# EAGLE design MIR50 (EAGLE 5.10)
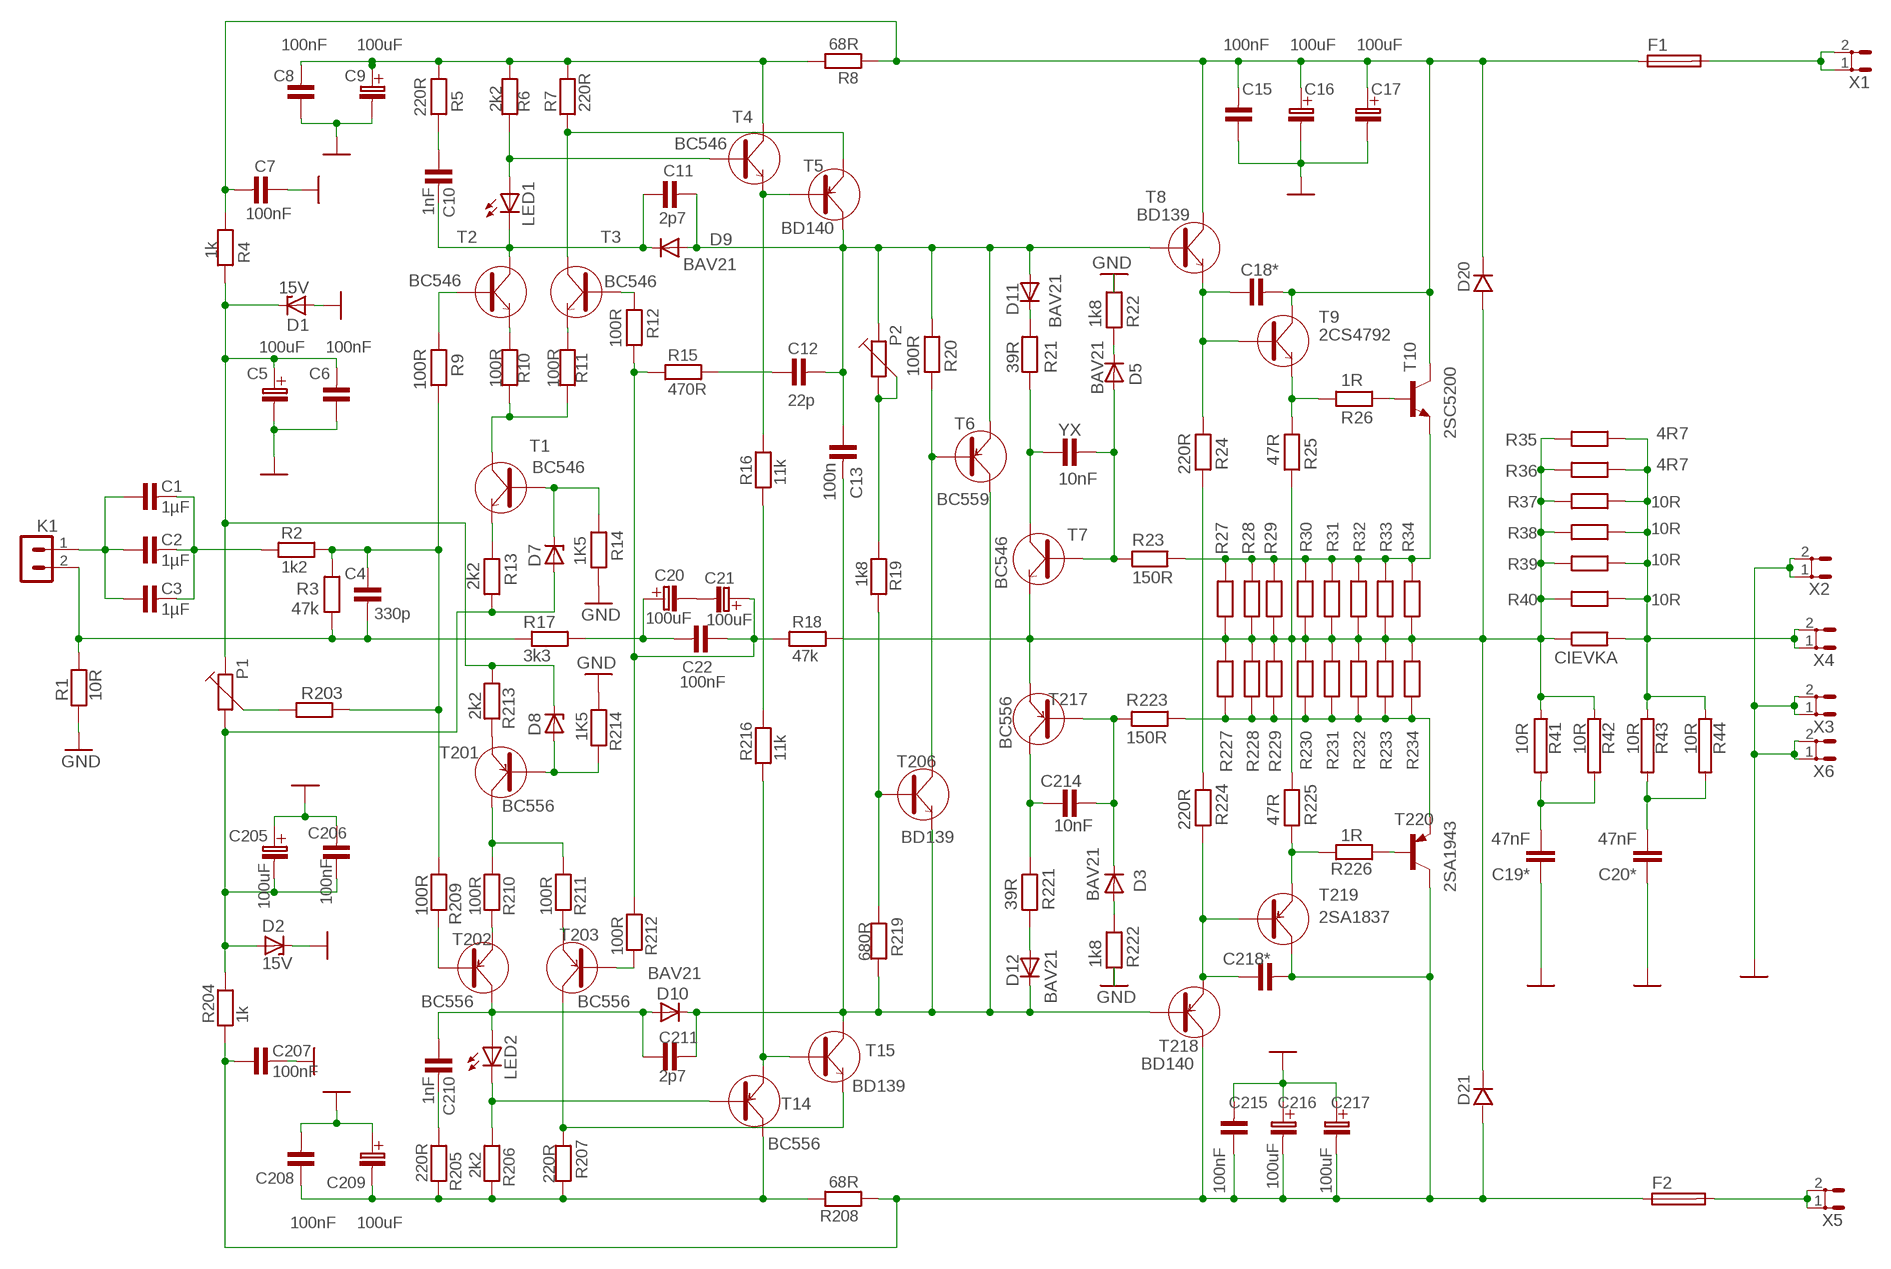
[diagram p0: schematic, sheet 1]

## Parts
C1  1µF  C-KERAMIK_5  [C-5]
C2  1µF  C-KERAMIK_5  [C-5]
C3  1µF  C-KERAMIK_5  [C-5]
C4  330p  C-KERAMIK_5  [C-5]
C5  100uF  C-ELEKTROLYT_2  [C-EL_2]
C6  100nF  C-KERAMIK_5  [C-5]
C7  100nF  C-KERAMIK_5  [C-5]
C8  100nF  C-KERAMIK_5  [C-5]
C9  100uF  C-ELEKTROLYT_3,5  [C-EL_3,5]
C10  1nF  C-KERAMIK_5  [C-5]
C11  2p7  C-KERAMIK_5  [C-5]
C12  22p  C-KERAMIK_5  [C-5]
C13  100n  C-KERAMIK_5  [C-5]
C15  100nF  C-KERAMIK_5  [C-5]
C16  100uF  C-ELEKTROLYT_3,5  [C-EL_3,5]
C17  100uF  C-ELEKTROLYT_3,5  [C-EL_3,5]
C18*  C-KERAMIK_5  [C-5]
C19*  47nF  C-EU150-054X183  [C150-054X183]
C20  100uF  C-ELEKTROLYT_3,5  [C-EL_3,5]
C20*  47nF  C-EU150-054X183  [C150-054X183]
C21  100uF  C-ELEKTROLYT_3,5  [C-EL_3,5]
C22  100nF  C-KERAMIK_5  [C-5]
C205  100uF  C-ELEKTROLYT_2  [C-EL_2]
C206  100nF  C-KERAMIK_5  [C-5]
C207  100nF  C-KERAMIK_5  [C-5]
C208  100nF  C-KERAMIK_5  [C-5]
C209  100uF  C-ELEKTROLYT_3,5  [C-EL_3,5]
C210  1nF  C-KERAMIK_5  [C-5]
C211  2p7  C-KERAMIK_5  [C-5]
C214  10nF  C-KERAMIK_5  [C-5]
C215  100nF  C-KERAMIK_5  [C-5]
C216  100uF  C-ELEKTROLYT_3,5  [C-EL_3,5]
C217  100uF  C-ELEKTROLYT_3,5  [C-EL_3,5]
C218*  C-KERAMIK_5  [C-5]
CIEVKA  10R  R-EU_0617/22  [0617/22]
D1  15V  BZD23  [SOD81]
D2  15V  BZD23  [SOD81]
D3  BAV21  [DO35-10]
D5  BAV21  [DO35-10]
D7  BZX55  [DO35Z10]
D8  BZX55  [DO35Z10]
D9  BAV21  [DO35-10]
D10  BAV21  [DO35-10]
D11  BAV21  [DO35-10]
D12  BAV21  [DO35-10]
D20  D_10  [DO41]
D21  D_10  [DO41]
F1  SH22,5A  [SH22,5A]
F2  SH22,5A  [SH22,5A]
K1  PSH02-02P  [PSH02-02P]
LED1  LED5MM  [LED5MM]
LED2  LED5MM  [LED5MM]
P1  TRIMR64Y  [64Y]
P2  TRIMR64Y  [64Y]
R1  10R  R_10  [R-10]
R2  1k2  R_10  [R-10]
R3  47k  R_10  [R-10]
R4  1k  R_10  [R-10]
R5  220R  R_10  [R-10]
R6  2k2  R_10  [R-10]
R7  220R  R_10  [R-10]
R8  68R  R_10  [R-10]
R9  100R  R_10  [R-10]
R10  100R  R_7,5  [R-7,5]
R11  100R  R_7,5  [R-7,5]
R12  100R  R_10  [R-10]
R13  2k2  R_10  [R-10]
R14  1K5  R_10  [R-10]
R15  470R  R_10  [R-10]
R16  11k  R_10  [R-10]
R17  3k3  R_10  [R-10]
R18  47k  R_10  [R-10]
R19  1k8  R_10  [R-10]
R20  100R  R_10  [R-10]
R21  39R  R_10  [R-10]
R22  1k8  R_10  [R-10]
R23  150R  R_10  [R-10]
R24  220R  R_10  [R-10]
R25  47R  R_10  [R-10]
R26  1R  R_10  [R-10]
R27  R__2W  [R-_2W]
R28  R__2W  [R-_2W]
R29  R__2W  [R-_2W]
R30  R_10  [R-10]
R31  R_10  [R-10]
R32  R_10  [R-10]
R33  R_10  [R-10]
R34  R_10  [R-10]
R35  4R7  R__2W  [R-_2W]
R36  4R7  R__2W  [R-_2W]
R37  10R  R_10  [R-10]
R38  10R  R_10  [R-10]
R39  10R  R_10  [R-10]
R40  10R  R_10  [R-10]
R41  10R  RAC01  [AC01]
R42  10R  RAC01  [AC01]
R43  10R  RAC01  [AC01]
R44  10R  RAC01  [AC01]
R203  R_10  [R-10]
R204  1k  R_10  [R-10]
R205  220R  R_10  [R-10]
R206  2k2  R_10  [R-10]
R207  220R  R_10  [R-10]
R208  68R  R_10  [R-10]
R209  100R  R_10  [R-10]
R210  100R  R_7,5  [R-7,5]
R211  100R  R_7,5  [R-7,5]
R212  100R  R_10  [R-10]
R213  2k2  R_10  [R-10]
R214  1K5  R_10  [R-10]
R216  11k  R_10  [R-10]
R219  680R  R_10  [R-10]
R221  39R  R_10  [R-10]
R222  1k8  R_10  [R-10]
R223  150R  R_10  [R-10]
R224  220R  R_10  [R-10]
R225  47R  R_10  [R-10]
R226  1R  R_10  [R-10]
R227  R__2W  [R-_2W]
R228  R__2W  [R-_2W]
R229  R__2W  [R-_2W]
R230  R_10  [R-10]
R231  R_10  [R-10]
R232  R_10  [R-10]
R233  R_10  [R-10]
R234  R_10  [R-10]
T1  BC546  [TO-92]
T2  BC546  [TO-92]
T3  BC546  [TO-92]
T4  BC546  [TO-92]
T5  BD140  [TO-126S]
T6  BC559  [TO-92]
T7  BC546  [TO-92]
T8  BD139  BD139_LEZ  [TO-126]
T9  2CS4792  BD711_LEZ  [TO-220]
T10  2SC5200  [TO-264]
T14  BC556  [TO-92]
T15  BD139  [TO-126S]
T201  BC556  [TO-92]
T202  BC556  [TO-92]
T203  BC556  [TO-92]
T206  BD139  BD139_LEZ  [TO-126]
T217  BC556  [TO-92]
T218  BD140  BD140_LEZ  [TO-126]
T219  2SA1837  BD912_LEZ  [TO-220]
T220  2SA1943  [TO-264]
X1  ST4,8  [ST4,8]
X2  ST4,8  [ST4,8]
X3  ST4,8  [ST4,8]
X4  ST4,8  [ST4,8]
X5  ST4,8  [ST4,8]
X6  ST4,8  [ST4,8]
YX  10nF  C-KERAMIK_5  [C-5]

## Nets
AERT?ZQA??: R16.1 R216.2
D7*: D8.A R214.2 T201.2(B)
GND: C5.C-(C_EL-) C6.1 C7.1 C8.1 C9.C-(C_EL-) C15.1 C16.C-(C_EL-) C17.C-(C_EL-) C19*.1 C20*.1 C205.C+(C_EL+) C206.2 C207.2 C208.2 C209.C+(C_EL+) C215.2 C216.C+(C_EL+) C217.C+(C_EL+) D1.A D2.C R1.1 R14.1 R22.2 R214.1 R222.1 X2.1 X2.2 X3.1 X3.2 X6.1 X6.2
N$1: C1.2 C2.2 C3.2 R2.1
N$2: C218*.1 R224.1 T218.1(E) T219.1(B)
N$3: C4.2 K1.2 R1.2 R3.1 R17.1
N$4: R13.2 T1.3(E)
N$5: C4.1 R2.2 R3.2 R9.1 R203.2 R209.1
N$6: R9.2 T2.2(B)
N$7: R10.2 T2.3(E)
N$8: D7.C R14.2 T1.2(B)
N$9: C205.C-(C_EL-) C206.1 D2.A D7.A P1.2 R13.1 R204.2
N$10: P1.3 R203.1
N$11: R213.2 T201.3(E)
N$12: R209.2 T202.2(B)
N$13: R210.2 T202.3(E)
N$14: R12.2 T3.2(B)
N$15: D5.C R22.1
N$16: R212.2 T203.2(B)
N$17: C7.2 C15.2 C16.C+(C_EL+) C17.C+(C_EL+) C18*.2 D20.K F1.1 R4.2 R8.1 T8.2(C) T9.2(C) T10.C
N$18: C21.C+(C_EL+) C22.1 R12.1 R15.1 R18.1 R212.1
N$19: C20.C-(C_EL-) C21.C-(C_EL-)
N$20: C8.2 C9.C+(C_EL+) R5.2 R6.2 R7.1 R8.2 T4.1(C)
N$21: C20.C+(C_EL+) C22.2 R17.2
N$22: C10.1 R5.1
N$23: C10.2 C11.1 D9.C LED1.K(C) T2.1(C)
N$24: LED2.K(C) R206.1 T14.2(B)
N$25: C19*.2 R41.2 R42.2
N$26: C18*.1 R24.2 T8.1(E) T9.1(B)
N$27: LED1.A R6.1 T4.2(B)
N$28: C210.2 R205.1
N$29: R7.2 T3.1(C) T5.1(E)
N$30: C208.1 C209.C-(C_EL-) R205.2 R206.2 R207.1 R208.2 T14.1(C)
N$31: R207.2 T15.1(E) T203.1(C)
N$33: R16.2 T4.3(E) T5.3(B)
N$34: C12.1 R15.2
N$35: C11.2 C12.2 C13.1 D9.A D11.A P2.1 R20.2 T5.2(C) T6.3(E) T8.3(B)
N$36: P2.2 P2.3 R19.1
N$37: C13.2 C211.2 D10.C D12.C R219.1 T6.1(C) T15.2(C) T206.1(E) T218.3(B)
N$38: R19.2 R219.2 T206.3(B)
N$39: R20.1 T6.2(B) T206.2(C)
N$40: R11.2 T3.3(E)
N$41: C214.2 D3.C R223.2 T217.2(B)
N$42: D11.C R21.1
N$43: R21.2 T7.1(C) YX.1
N$44: D12.A R221.1
N$45: C214.1 R221.2 T217.1(C)
N$46: D3.A R222.2
N$47: D5.A R23.1 T7.2(B) YX.2
N$49: R10.1 R11.1 T1.1(C)
N$50: R24.1 R224.2
N$51: R211.2 T203.3(E)
N$54: C207.1 C215.1 C216.C-(C_EL-) C217.C-(C_EL-) C218*.2 D21.A F2.1 R204.1 R208.1 T218.2(C) T219.2(C) T220.C
N$55: R210.1 R211.1 T201.1(C)
N$56: R25.2 R26.1 T9.3(E)
N$57: R225.1 R226.2 T219.3(E)
N$58: R23.2 R27.2 R28.2 R29.2 R30.2 R31.2 R32.2 R33.2 R34.2 T10.E
N$59: R223.1 R227.1 R228.1 R229.1 R230.1 R231.1 R232.1 R233.1 R234.1 T220.E
N$61: F1.2 X1.1 X1.2
N$62: R26.2 T10.B
N$63: F2.2 X5.1 X5.2
N$64: R226.1 T220.B
N$67: C210.1 C211.1 D10.A LED2.A T202.1(C)
N$76: CIEVKA.1 D20.A D21.K R18.2 R25.1 R27.1 R28.1 R29.1 R30.1 R31.1 R32.1 R33.1 R34.1 R35.1 R36.1 R37.2 R38.2 R39.2 R40.2 R41.1 R42.1 R225.2 R227.2 R228.2 R229.2 R230.2 R231.2 R232.2 R233.2 R234.2 T7.3(E) T217.3(E)
N$77: R216.1 T14.3(E) T15.3(B)
N$89: C5.C+(C_EL+) C6.2 D1.C D8.C P1.1 R4.1 R213.1
N$180: C20*.2 R43.2 R44.2
N$181: C1.1 C2.1 C3.1 K1.1
OUT: CIEVKA.2 R35.2 R36.2 R37.1 R38.1 R39.1 R40.1 R43.1 R44.1 X4.1 X4.2

## Library data of the parts
C1-C4 C6-C8 C11-C13 C15 C18* C22 C206-C208 C211 C214 C215 C218* YX = #PaJa_22:C-KERAMIK: Kondenzator - keramicky
C5 C9 C16 C17 C20 C21 C205 C209 C216 C217 = #PaJa_22:C-ELEKTROLYT: Kondenzator - elektrolyticky
C10 C210 = #PaJa_30:C-KERAMIK: Kondenzator - keramicky
C19* C20* = rcl:C-EU: CAPACITOR, European symbol
CIEVKA = rcl:R-EU_: RESISTOR, European symbol
D1 D2 = DIODE moje:BZD23: Z DIODE
D3 D5 D9-D12 = DIODE moje:BAV21: DIODE high-voltage general purpose diode
D7 D8 = DIODE moje:BZX55: Z DIODE
D20 D21 = #PaJa_22:D: Dioda - univerzální
F1 F2 = fuse:SH22,5A: FUSE HOLDER grid 22,5mm, isolated cap OGN0031 8201, Schurter (Buerklin)
K1 = #PaJa_22:PSH02-02: Konektory se zamkem - vidlice - 2pin
LED1 LED2 = LED moje:LED: LED OSRAM: - CHIPLED LG R971, LG N971, LY N971, LG Q971, LY Q971, LO R971, LY R971 LH N974, LH R974 LS Q976, LO Q976, LY Q976 LO Q996 - Hyper CHIPLED LW Q18S LB Q993, LB Q99A, LB R99A - SideLED LS A670, LO A670, LY A670, LG A670, LP A670 LB A673, LV A673, LT A673, LW A673 LH A674 LY A675 LS A676, LA A676, LO A676, LY A676, LW A676 LS A679, LY A679, LG A679 - Hyper Micro SIDELED® LS Y876, LA Y876, LO Y876, LY Y876 LT Y87S - SmartLED LW L88C, LW L88S LB L89C, LB L89S, LG L890 LS L89K, LO L89K, LY L89K LS L896, LA L896, LO L896, LY L896 - TOPLED LS T670, LO T670, LY T670, LG T670, LP T670 LSG T670, LSP T670, LSY T670, LOP T670, LYG T670 LG T671, LOG T671, LSG T671 LB T673, LV T673, LT T673, LW T673 LH T674 LS T676, LA T676, LO T676, LY T676, LB T676, LH T676, LSB T676, LW T676 LB T67C, LV T67C, LT T67C, LS T67K, LO T67K, LY T67K, LW E67C LS E67B, LA E67B, LO E67B, LY E67B, LB E67C, LV E67C, LT E67C LW T67C LS T679, LY T679, LG T679 LS T770, LO T770, LY T770, LG T770, LP T770 LB T773, LV T773, LT T773, LW T773 LH T774 LS E675, LA E675, LY E675, LS T675 LS T776, LA T776, LO T776, LY T776, LB T776 LHGB T686 LT T68C, LB T68C - Hyper Mini TOPLED® LB M676 - Mini TOPLED Santana® LG M470 LS M47K, LO M47K, LY M47K Source: http://www.osram.convergy.de/
P1 P2 = #PaJa_30:TRIMR: Trimr
R1-R3 R5-R9 R12-R14 R17-R19 R21 R203 R205-R208 R212-R214 R216 R219 R221 = #PaJa_30:R: Rezistor
R4 R10 R11 R15 R16 R20 R22-R40 R204 R209-R211 R222-R234 = #PaJa_22:R: Rezistor
R41-R44 = resistor-power:R: Power Resitor
T1-T4 T7 = #PaJa_22:BC546: Tranzistor NPN - Univerzalni NF - Ic=0,1A
T5 = #PaJa_22:BD140: Tranzistor PNP - Vykonovy - Ic=1,5A
T6 = #PaJa_22:BC559: Tranzistor PNP - Univerzalni NF - Ic=0,1A
T8 T206 = #PaJa_30:BD139: Tranzistor NPN - Vykonovy - Ic=1,5A
T9 = #PaJa_22:BD711: Tranzistor NPN - Vykonovy - Ic=12A
T10 = TO264:2SC5200
T14 T201-T203 T217 = #PaJa_22:BC556: Tranzistor PNP - Univerzalni NF - Ic=0,1A
T15 = #PaJa_22:BD139: Tranzistor NPN - Vykonovy - Ic=1,5A
T218 = #PaJa_30:BD140: Tranzistor PNP - Vykonovy - Ic=1,5A
T219 = #PaJa_22:BD912: Tranzistor PNP - Vykonovy - Ic=15A
T220 = TO264:2SA1943
X1-X6 = con-rib:ST4,8: RIBBON CABLE CONNECTOR Flachstecker / Faston

## Board
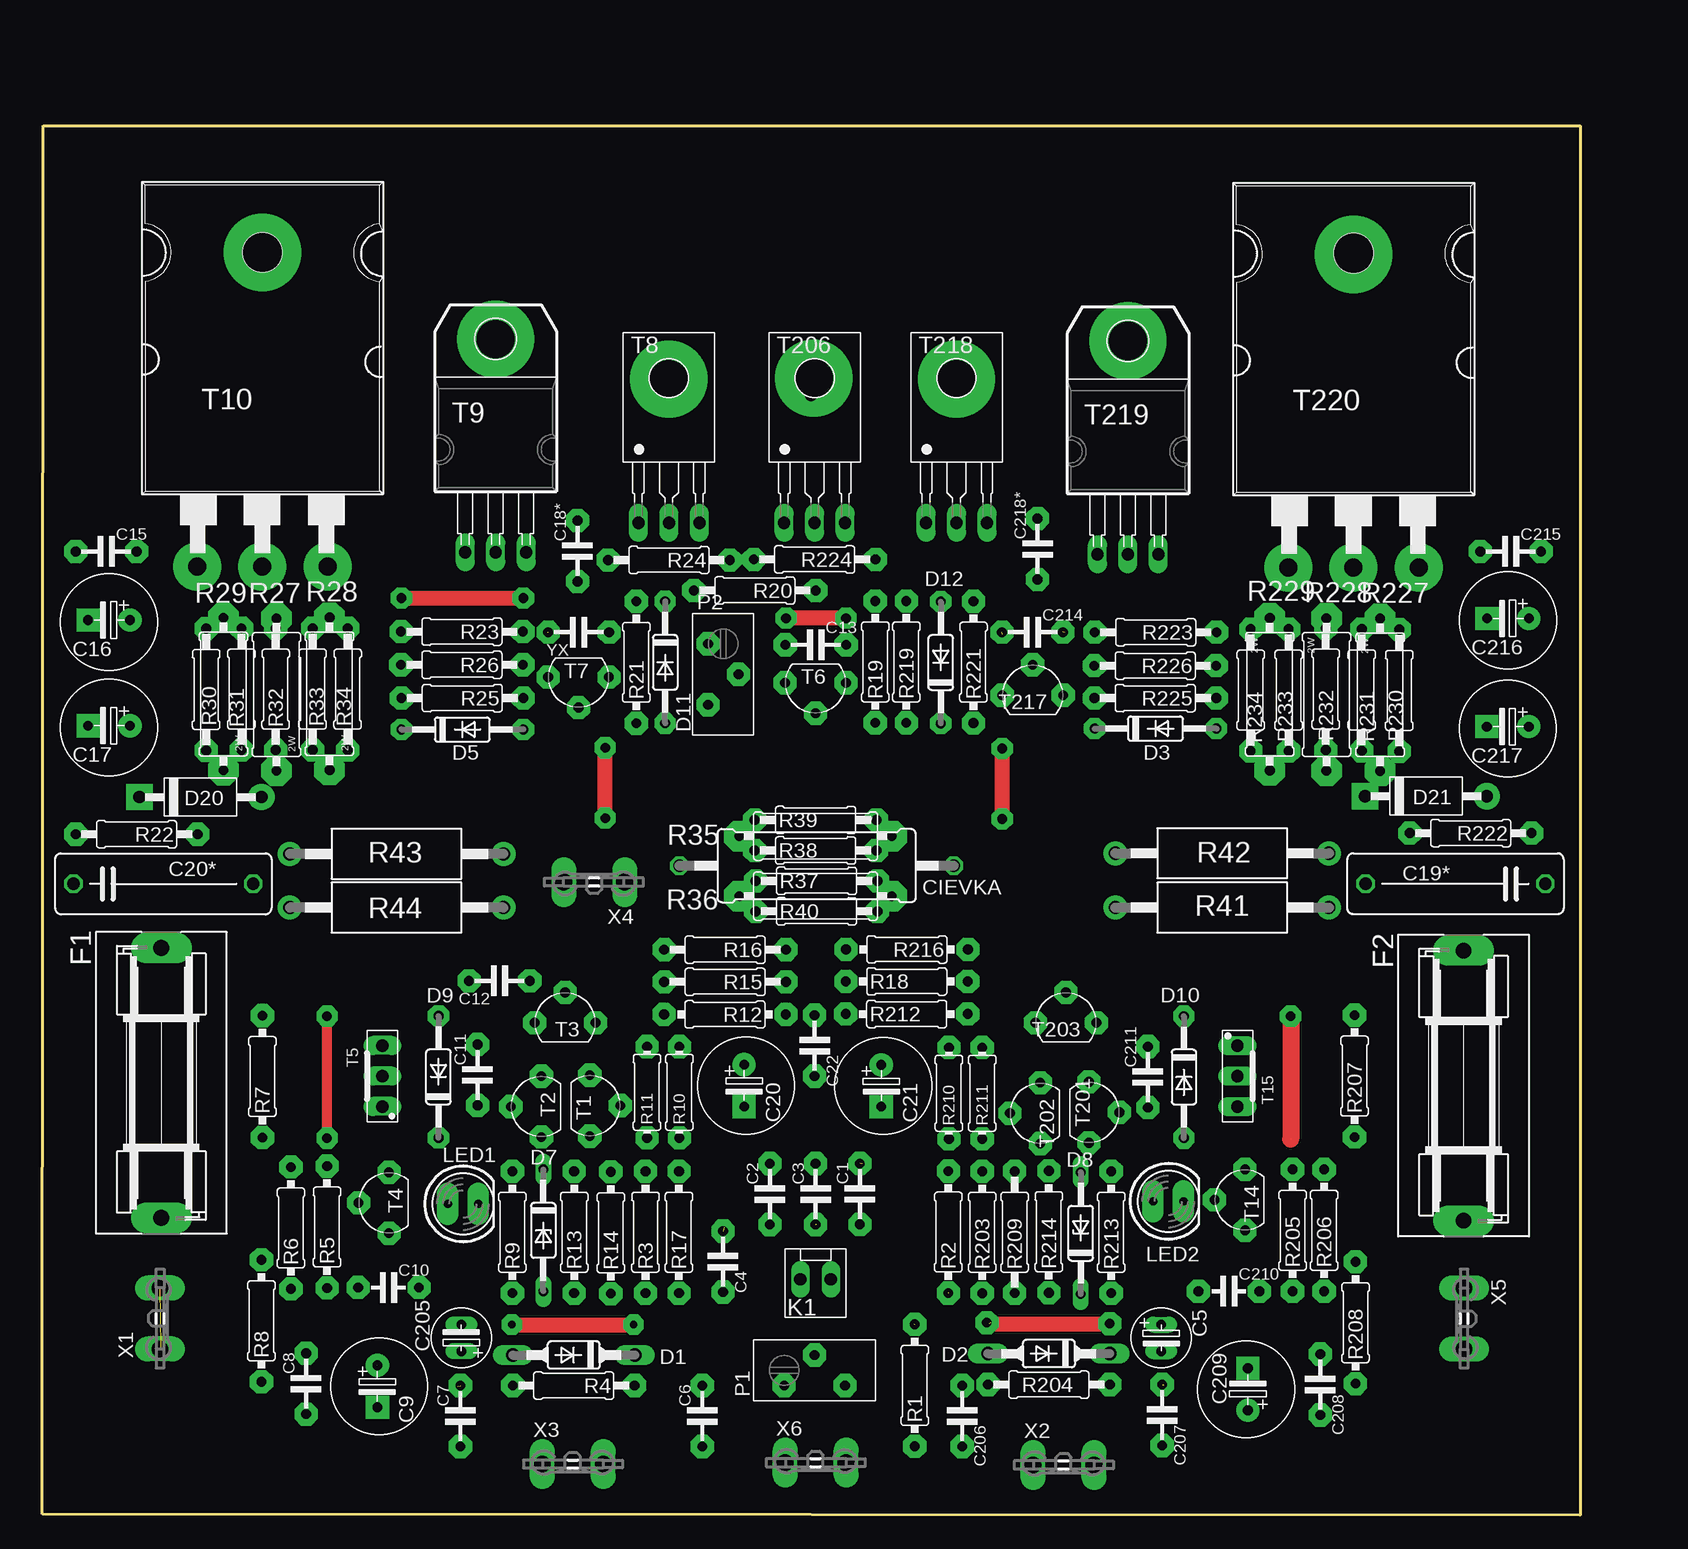
[diagram p1: board, top side]
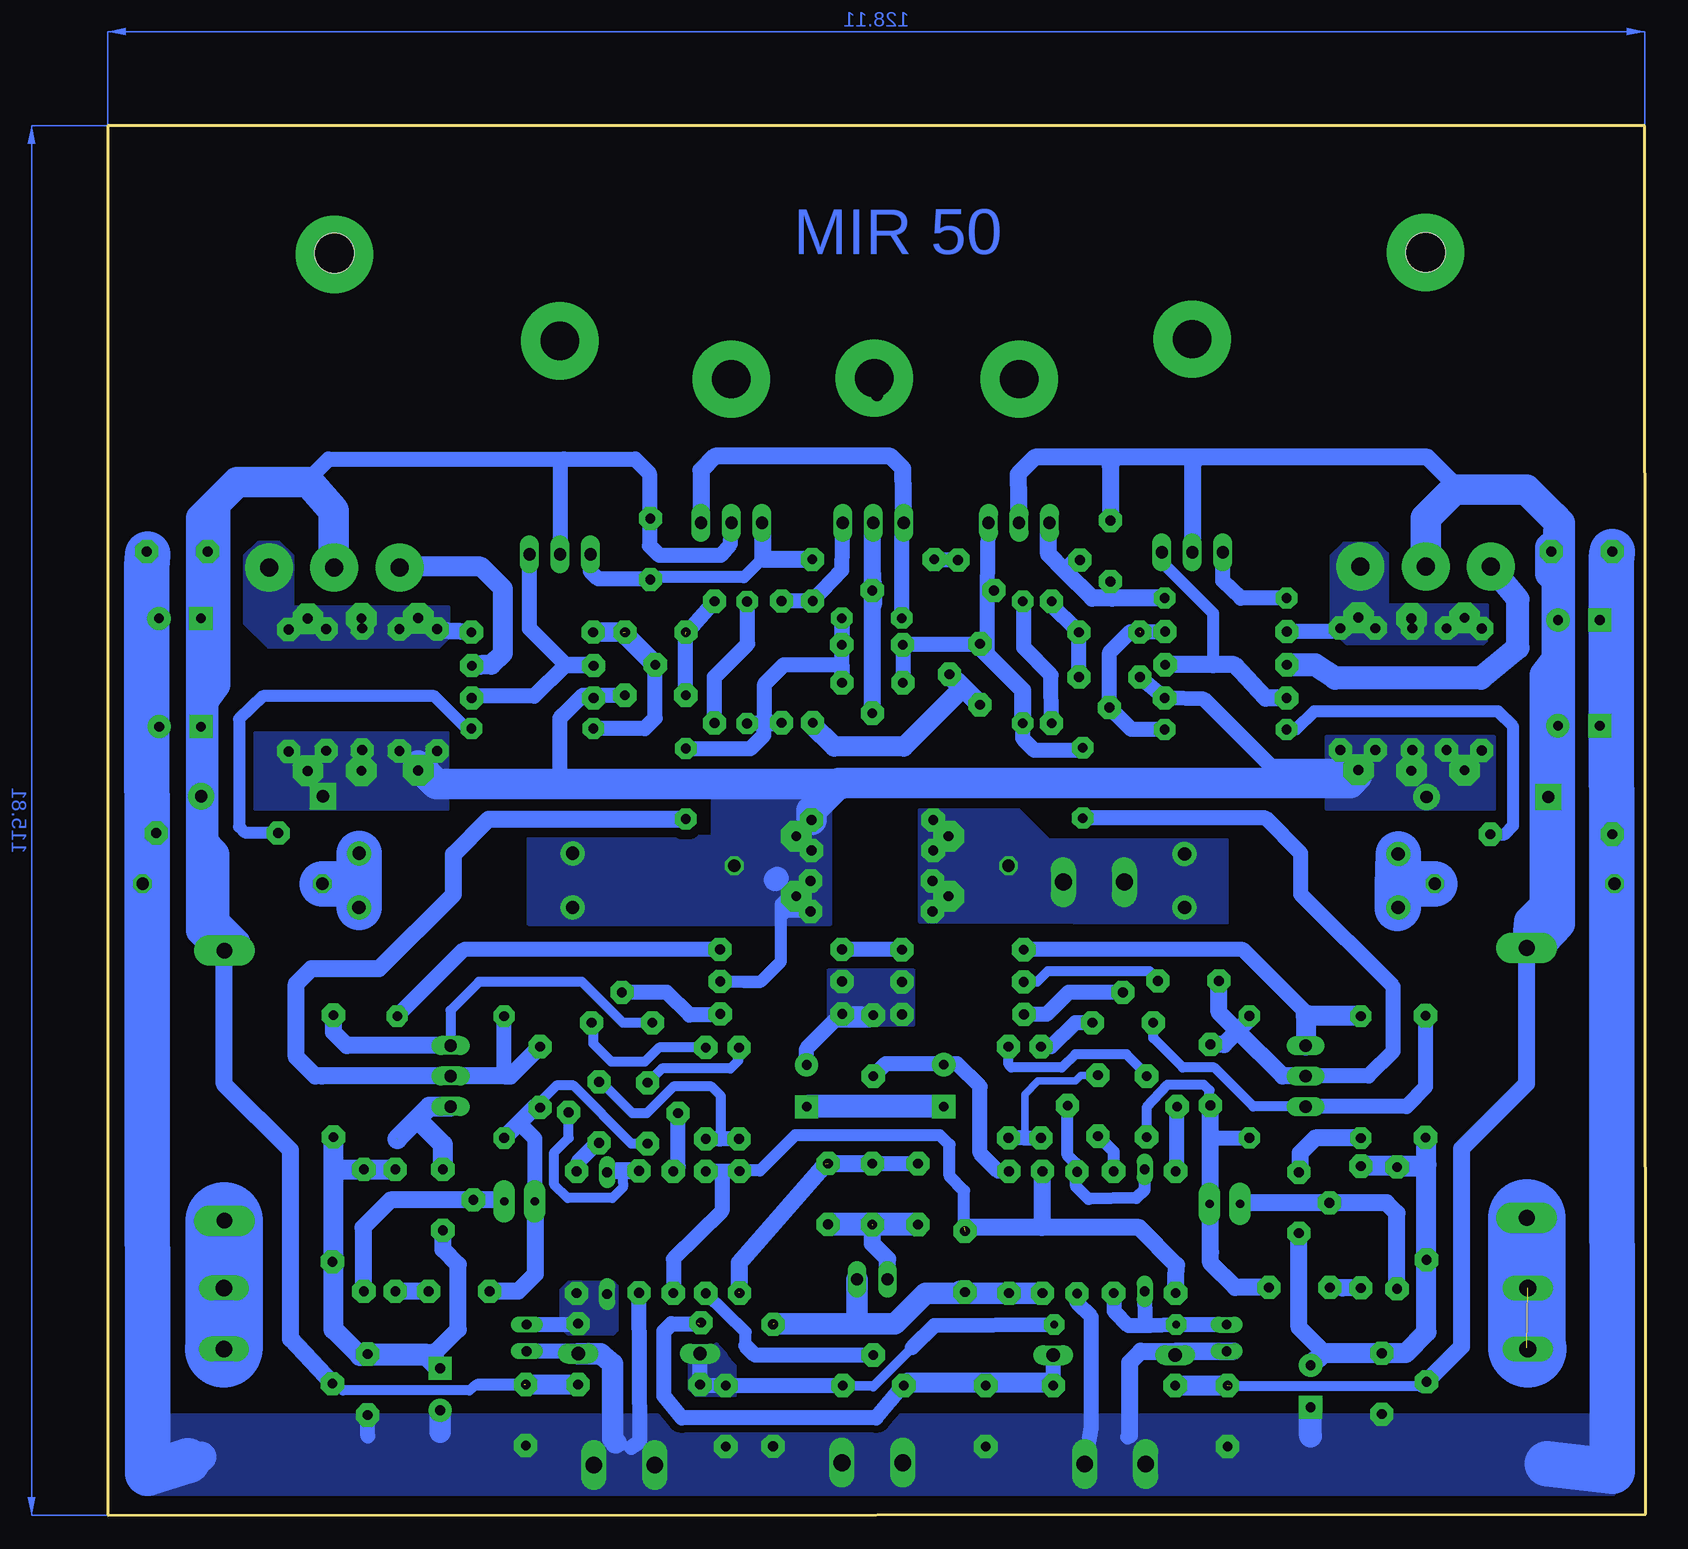
[diagram p2: board, bottom side, seen from below]

Size 128.19 x 115.81 mm. Coordinates in mm from the lower left corner, seen from the top.
Outline: 0.08,115.81 128.19,115.81 128.19,0 0,0.08 0.08,115.81
Copper layers (1*16): Top 0.035mm / dielectric 1.5mm / Bottom 0.035mm
Design rules "default": minimum track width 10mil, minimum drill 24mil, track to track 8mil, track to pad 8mil, pad to pad 8mil, via to via 8mil, smd to smd 8mil, copper to edge 40mil, drill to drill 8mil, minimum pad ring 10mil, minimum via ring 8mil, stop-mask expansion 4mil, vias tented up to drill 0mil, thermal gap 10mil

### Footprints (pad centres in the part's own frame; a part is rotated, then mirrored left to right if it is on the bottom)
C-5 = drill 0.813 pad 1.93 octagon: 1 -2.54,0; 2 2.54,0
C-EL_2 = drill 0.813 pad 1.27 long: C+ 0,0; C- 2.223,0
C-EL_3,5 = drill 0.813 pad 1.93: C+ 0,0 | drill 0.813 pad 1.93 square: C- 3.493,0
C150-054X183 = drill 1.016 octagon: 1 -7.493,0; 2 7.493,0
0617/22 = drill 1.016 octagon: 1 -11.43,0; 2 11.43,0
SOD81 = drill 1.118 long: A 5.08,0; C -5.08,0
DO35-10 = drill 0.813 pad 1.778 octagon: A 5.08,0; C -5.08,0
DO35Z10 = drill 0.813 long: A 5.08,0; C -5.08,0
DO41 = drill 1.016 pad 2.184: A -5.08,0 | drill 1.016 pad 2.184 square: K 5.08,0
SH22,5A = drill 1.321 pad 2.54 long: 1 -11.252,0; 2 11.252,0
PSH02-02P = drill 1.016 pad 1.422 long: 1 -1.27,0; 2 1.27,0
LED5MM = drill 0.7 pad 1.778 long: A -1.27,0; K 1.27,0
64Y = drill 0.813 pad 1.93 octagon: 1 0,2.54; 2 0,-2.54; 3 2.54,0
R-10 = drill 0.813 pad 1.93 octagon: 1 -5.08,0; 2 5.08,0
R-7,5 = drill 0.813 pad 1.93 octagon: 1 -3.81,0; 2 3.81,0
R-_2W = drill 0.813 pad 2.54 octagon: 1 -6.35,0; 2 6.35,0
AC01 = drill 1.1 pad 2: 1 -8.9,0; 2 8.9,0
TO-92 = drill 0.813 pad 1.93 octagon: 1 0,2.54; 2 2.54,0; 3 0,-2.54
TO-126S = drill 1.016 pad 1.6 long: 1 -2.54,0; 2 0,0; 3 2.54,0
TO-126 = drill 1.016 pad 1.6 long: 1 -2.54,-12.065; 2 0,-12.065; 3 2.54,-12.065
TO-220 = drill 1.016 pad 1.6 long: 1 -2.54,0; 2 0,0; 3 2.54,0
TO-264 = drill 1.5 pad 4: B -5.45,-6.096; E 5.45,-6.096 | drill 1.499 pad 4: C 0,-6.096 | hole 3.3: 0,20.09
ST4,8 = drill 1.397 long: 1 -2.54,0; 2 2.54,0

### Placement (x,y rotation side)
C1  68.14,26.77 90 top
C2  60.64,26.75 90 top
C3  64.45,26.75 90 top
C4  56.74,21.13 270 top
C5  93.27,15.88 270 top
C6  55.01,8.26 90 top
C7  34.85,8.26 90 top
C8  21.99,10.95 90 top
C9  27.92,12.48 270 top
C10  28.85,18.97 0 top
C11  36.27,36.69 90 top
C12  38.1,44.53 180 top
C13  64.47,72.55 0 top
C15  5.32,80.33 0 top
C16  7.3,74.61 180 top
C17  7.3,65.8 180 top
C18*  44.61,80.37 90 top
C19*  117.79,52.63 180 top
C20  58.5,37.54 270 top
C20*  10.08,52.63 0 top
C21  69.93,37.53 270 top
C22  64.37,39.13 270 top
C205  34.92,13.65 90 top
C206  76.68,8.26 270 top
C207  93.34,8.33 270 top
C208  106.52,10.87 270 top
C209  100.49,8.73 90 top
C210  98.9,18.65 0 top
C211  92.15,36.51 90 top
C214  82.53,73.6 0 top
C215  122.4,80.33 0 top
C216  123.92,74.75 180 top
C217  123.9,65.72 180 top
C218*  82.95,80.53 90 top
CIEVKA  64.53,54.13 180 top
D1  44.29,13.34 180 top
D2  83.9,13.45 180 top
D3  92.79,65.56 0 top
D5  35,65.48 0 top
D7  41.75,23.73 270 top
D8  86.56,23.5 90 top
D9  33.02,36.53 90 top
D10  95.15,36.51 270 top
D11  51.91,71.09 270 top
D12  74.89,71.06 90 top
D20  13.18,59.85 180 top
D21  115.33,59.93 180 top
F1  9.91,36.02 270 top
F2  118.47,35.8 270 top
K1  64.45,19.65 0 top
LED1  35.07,25.94 0 top
LED2  93.86,26.15 0 top
P1  64.37,10.8 90 top
P2  55.48,70.09 0 top
R1  72.72,10.81 90 top
R2  75.52,23.59 90 top
R3  50.28,23.57 90 top
R4  44.29,10.8 180 top
R5  23.73,24.01 90 top
R6  20.72,23.93 90 top
R7  18.34,36.55 90 top
R8  18.26,16.19 90 top
R9  39.17,23.57 90 top
R10  53.1,35.24 90 top
R11  50.4,35.24 90 top
R12  56.9,41.74 180 top
R13  44.33,23.57 90 top
R14  47.39,23.54 90 top
R15  56.91,44.45 180 top
R16  56.91,47.13 180 top
R17  53.06,23.57 90 top
R18  72.06,44.48 0 top
R19  69.43,71.12 90 top
R20  59.39,77.07 180 top
R21  49.51,71.09 90 top
R22  7.86,56.75 180 top
R23  34.97,73.64 180 top
R24  52.23,79.61 180 top
R25  35,68.1 180 top
R26  34.97,70.88 180 top
R27  19.52,68.39 90 top
R28  23.94,68.46 90 top
R29  15.09,68.44 90 top
R30  13.65,68.82 90 top
R31  16.59,68.85 90 top
R32  19.45,68.85 90 top
R33  22.53,68.85 90 top
R34  25.45,68.85 90 top
R35  64.45,56.59 180 top
R36  64.45,51.59 180 top
R37  64.53,52.86 0 top
R38  64.45,55.4 0 top
R39  64.45,57.94 0 top
R40  64.53,50.32 0 top
R41  98.35,50.64 0 top
R42  98.35,55.17 0 top
R43  29.53,55.12 180 top
R44  29.53,50.64 180 top
R203  78.34,23.57 90 top
R204  83.9,10.87 180 top
R205  104.22,23.73 90 top
R206  106.84,23.73 90 top
R207  109.38,36.59 90 top
R208  109.46,16.03 90 top
R209  81.04,23.57 90 top
R210  75.56,35.16 90 top
R211  78.34,35.16 90 top
R212  72.05,41.77 0 top
R213  89.1,23.57 90 top
R214  83.9,23.61 90 top
R216  72.07,47.15 180 top
R219  72.02,71.12 90 top
R221  77.61,71.1 90 top
R222  119.06,56.85 180 top
R223  92.81,73.6 180 top
R224  64.37,79.66 180 top
R225  92.77,68.1 180 top
R226  92.76,70.8 180 top
R227  111.52,68.38 270 top
R228  107.04,68.4 270 top
R229  102.31,68.42 270 top
R230  113.11,68.74 270 top
R231  109.98,68.79 270 top
R232  106.98,68.85 270 top
R233  103.89,68.77 270 top
R234  100.73,68.77 270 top
T1  45.64,34.13 0 top
T2  41.59,34.05 180 top
T3  43.58,41.04 90 top
T4  28.89,26.04 180 top
T5  28.34,36.59 90 top
T6  64.45,69.37 270 top
T7  44.69,69.85 270 top
T8  52.23,94.77 0 top
T9  37.78,80.25 0 top
T10  18.34,85.17 0 top
T14  100.25,26.27 180 top
T15  99.62,36.59 270 top
T201  87.23,33.58 0 top
T202  83.18,33.5 180 top
T203  85.33,41.04 90 top
T206  64.37,94.77 0 top
T217  82.55,68.34 90 top
T218  76.2,94.77 0 top
T219  90.49,80.09 0 top
T220  109.3,85.09 0 top
X1  9.81,16.38 90 top
X2  85.12,4.18 0 top
X3  44.21,4.25 0 top
X4  45.99,52.77 180 top
X5  118.51,16.38 270 top
X6  64.45,4.37 0 top
YX  44.7,73.6 180 top

### Tracks (layer width: path | path; a pad name or v marks a point on that pad's centre or on a via)
AERT?ZQA??
  Bottom 1.27: R16.1 66.93,47.13 R216.2
D7*
  Bottom 0.813: T201.2 89.77,31.43 90.96,30.24 90.96,27.54 89.85,26.43 86.12,26.43 85.25,27.31 85.33,28.69
  Bottom 1.422: R214.2 85.33,28.69 86.44,28.69 D8.A
GND
  Bottom 1.27: R214.1 83.82,6.11 84.53,5.64 | 85.8,6.03 86.04,5.79 85.96,5.79 85.88,5.87 | C17.C- | 124.86,80.09 123.92,80.09 C216.C+ C217.C+ 124.14,65.72 R222.1 123.9,56.85 C19*.1 | C15.1 3.81,80.33 C16.C- C17.C- | C17.C- | C17.C- R22.2 3.81,56.75 C20*.1 | C5.C- 89.02,13.65 D2.C | C205.C+ 42.07,13.65 43.02,12.7 | 43.02,6.67 43.18,6.51 | R14.1 47.39,17.7 46.2,16.51 46.2,7.27 X3.2 | 106.44,8.41 106.52,8.41 106.52,6.59
  Bottom 1.422: D1.A 39.13,13.65 34.29,13.65 42.07,13.65 43.02,12.7 43.02,6.67
  Bottom 1.778: D2.C 87.11,13.45 86.12,12.62 86.12,6.35 85.8,6.03 | 100.49,6.91 C209.C+ | C215.2 124.94,79.37 124.94,79.06
  Bottom 1.93: 27.94,6.59 27.94,8.97
  Bottom 2.54: 121.52,4.52 120.41,4.84
  Bottom 3.81: C15.1 2.86,79.69 2.78,3.65 8.17,4.29 | 121.52,4.52 124.86,3.49 124.94,79.06 124.86,80.09
  pour Bottom (isolate 0.61, no thermals): 1.11,8.33 125.57,8.33 125.41,1.75 2.62,1.75
N$1  (2 unrouted)
  Bottom 1.27: 67.47,29.29 67.48,29.31 | C2.2 C3.2 | C3.2
  Bottom 1.422: C3.2 67.47,29.29 68.34,29.29 75.56,21.03 75.56,18.56
  Bottom 1.93: C2.2 60.66,29.31
N$2
  Bottom 1.016: 83.03,78.18 75.17,78.18 73.58,79.77
  Bottom 1.27: 73.58,82.71 T218.1 | T219.1 87.95,78.66 87.31,78.03 82.99,78.03 C218*.1
  Bottom 1.422: 73.58,82.71 73.58,79.77 73.47,79.66 R224.1 | C218*.1 82.95,78.11 83.03,78.18
N$3  (1 unrouted)
  Bottom 1.778: R3.1 57.31,18.49 | 57.31,18.49 60.01,18.49 62.55,15.95 66.2,15.95 | 66.2,15.95 72.66,15.95 | K1.2 65.72,16.43 66.2,15.95 | C4.2 57.13,18.67 57.31,18.49 | R3.1 R17.1 | R3.1
N$4
  Bottom 1.016: R13.2 44.33,30.28 T1.3
N$5  (1 unrouted)
  Bottom 1.016: 56.8,23.97 56.8,27.04 58.02,28.26 58.02,30.88 58.82,31.67 70.88,31.67 73.82,28.73 75.45,28.73 R2.2
  Bottom 1.27: R209.1 81.04,21.35 76.99,25.32 76.99,28.67 | R2.2 76.99,28.67 | 76.99,28.67 78.41,28.67 R203.2
  Bottom 1.422: R9.1 39.09,20.84 42.23,23.97 50.32,23.97 | 50.32,23.97 56.8,23.97 | R3.2 50.28,24.02 50.32,23.97
N$6
  Bottom 1.27: T2.2 39.05,28.77 R9.2
N$7
  Bottom 0.813: T2.3 41.59,36.75 43.26,38.42 47.54,38.42 48.66,37.31 52.86,37.31 53.1,37.54 R10.2
N$8
  Bottom 1.016: D7.C 41.75,27.15 42.46,26.43 46.43,26.35 47.47,27.38 47.47,28.73 47.47,29.29 48.18,30 T1.2 | T1.2
  Bottom 1.422: R14.2 47.39,28.65 47.47,28.73
N$9  (via drill 0.6 pad 1.68)
  Top 1.27: v39.13,15.88 v49.29,15.87
  Bottom 0.813: 61.12,13.97 61.28,13.81 64.37,10.72 P1.2
  Bottom 1.27: P1.2 74.77,10.79 | 74.77,10.79 78.58,10.79 R204.2 78.82,13.37 D2.A | C206.1 76.52,10.8 74.77,10.79 | C205.C- v39.13,15.88 41.35,15.8 | v49.29,15.87 59.29,15.8 61.12,13.97 | 41.35,15.8 43.1,15.8 44.29,16.99 44.29,18.45 R13.1 | D7.A 41.67,16.11 41.35,15.8
  pour Bottom (isolate 1.016, no thermals): 79.37,14.45 77.55,14.45 75.88,12.62 75.88,9.92 79.14,9.92 79.69,10.48 79.69,14.13
N$10
  Bottom 1.016: 75.01,14.13 75.01,15.24 R203.1
  Bottom 1.27: P1.3 74.22,13.33 75.01,14.13
N$11
  Bottom 1.27: T201.3 87.39,31.04 88.98,29.45 88.98,28.54 R213.2
N$12
  Bottom 1.27: T202.2 80.64,29.05 R209.2
N$13
  Bottom 0.813: R210.2 75.64,37.86 76.28,37.23 81.99,37.23 T202.3
N$14
  Bottom 1.27: T3.2 48.1,43.58 49.93,41.75 51.72,41.75 R12.2
N$15
  Bottom 1.016: D5.C 29.13,65.48 27.62,66.99 12.3,66.99 11.03,65.72 11.03,57.47 11.75,56.75 12.86,56.67 R22.1
N$16
  Bottom 1.27: T203.2 81.6,43.58 79.69,41.67 77.16,41.67 R212.2
N$17  (1 unrouted)
  Bottom 0.813: 18.65,10.72 34.61,10.72
  Bottom 1.016: 34.61,10.72 34.61,11.03 | R8.1 18.65,10.72
  Bottom 1.27: D20.K 8.1,65.01 C17.C+ 8.41,66.91 8.41,70.01 | C16.C+ 7.3,71.52 7.38,71.44
  Bottom 1.422: T8.2 52.31,86.76 50.88,88.19 44.45,88.19 | 37.31,88.19 18.18,88.19 15.48,85.49 | 37.31,88.19 44.45,88.19 | T9.2 37.78,87.71 37.31,88.19 | C18*.2 44.61,87.47 44.45,88.19 | F1.1 9.91,35.96 15.32,30.56 15.32,14.05 R8.1
  Bottom 1.676: C7.2 R4.2 | C7.2
  Bottom 2.54: 7.38,51.83 9.68,49.54 F1.1 9,47.27 7.14,49.29 7.14,82.71 7.62,83.18 | 7.38,51.83 7.38,71.44 7.38,77.95 | 7.38,77.95 7.22,82.79 9.92,85.49 15.48,85.49 15.95,85.49 18.33,83.11 T10.C | T10.C | C15.2 7.78,80.41 7.94,80.64 7.94,78.5 7.38,77.95 | 7.38,51.83 8.17,51.83 8.41,51.36 8.41,70.01 7.7,70.96
N$18
  Bottom 1.27: R212.1 65.26,41.77 64.77,41.27 67.55,41.27 69.93,38.89 C21.C+
  pour Bottom (no thermals): 61.04,45.01 61.04,40.8 68.1,40.8 68.1,45.48 61.04,45.48
N$19
  Bottom 1.93: C20.C- 69.91,34.05 C21.C-
N$20  (1 unrouted)
  Bottom 1.422: 26.83,13.57 26.75,13.49 | 26.83,13.57 28.89,15.64 T4.1 | T4.1 | C9.C+ 26.83,13.57
  Bottom 1.676: 18.26,29.21 R8.2 18.26,15.24 20,13.49 20.56,13.49 | 18.26,29.21 18.26,31.39 R7.1 | 18.38,29.09 R5.2 | 18.26,29.21 18.38,29.09 | R6.2 18.45,29.01 18.38,29.09 | 20.56,13.49 26.91,13.49 C9.C+ | 20.56,13.49 C8.2 | 20.56,13.49
N$21
  Bottom 1.27: R17.2 53.97,28.65 55.48,30.16 55.48,35.72 57.39,37.62 57.94,37.62 | 57.94,37.62 63.34,37.62 C22.2 | C20.C+ 58.02,37.54 57.94,37.62
N$22
  Bottom 1.422: R5.1 25.24,18.93 C10.1
N$23
  Bottom 0.813: T2.1 41.59,33.97 39.85,35.88 36.83,35.88 36.35,35.4 36.35,34.07 C11.1
  Bottom 1.016: LED1.K 36.34,21.97 36.27,21.91
  Bottom 1.27: D9.C 35.97,31.45 36.27,31.75
  Bottom 1.422: C10.2 34.21,18.97 36.27,21.03 36.27,21.91 36.27,31.75 36.27,33.83 C11.1
N$24
  Bottom 1.422: LED2.K 95.09,26.27 T14.2 104.62,26.27 106.92,23.97 106.92,18.73 R206.1
N$25
  Bottom 3.81: 107.24,52.78 R41.2 | 107.24,52.78 R42.2 | C19*.2 107.4,52.63 107.24,52.78
N$26  (via drill 0.8 pad 1.78)
  Top 1.27: v29.92,76.44 v40.08,76.44
  Bottom 1.27: v29.92,76.44 33.73,76.44 35.24,77.87 T9.1 | T9.1
  Bottom 1.422: v40.08,76.44 44.45,76.44 | 44.45,76.44 46.12,76.44 48.38,78.7 | 48.38,78.7 49.77,80.09 49.77,82.79 T8.1 | R24.2 47.47,79.61 48.38,78.7 | C18*.1 44.61,76.6 44.45,76.44
N$27
  Bottom 1.422: R6.1 20.72,25.16 21.59,26.04 21.99,26.04 | 21.99,26.04 33.7,26.04 LED1.A | 21.99,26.04 T4.2 | 21.99,26.04
N$28
  Bottom 1.422: C210.2 103.98,18.65 R205.1
N$29
  Bottom 0.813: T5.1 32.7,34.05 35.96,37.31 38.58,37.31 41.04,39.77 T3.1
  Bottom 1.27: T5.1 19.92,34.05 18.33,35.72 18.33,41.55 R7.2
N$30
  Bottom 1.422: T14.1 100.25,22.15 98.98,20.88 98.98,15.48 100.96,13.49 101.36,13.1 | R208.2 109.46,16.51 109.38,16.43
  Bottom 1.676: 109.38,28.89 109.38,16.43 109.38,15.48 107.16,13.26 101.2,13.26 100.96,13.49 | 109.38,28.89 109.38,28.97 | 109.38,28.97 R207.1 | R205.2 109.3,28.81 109.38,28.89 | R206.2 109.22,28.81 109.38,28.97
  Bottom 1.778: C208.1 101.68,13.41 101.36,13.1 C209.C-
N$31
  Bottom 0.813: T203.1 85.25,41.04 87.79,43.58 | 87.79,43.58 | 87.79,43.58 88.66,44.45 97.23,44.45 99.61,42.07 T15.1
  Bottom 1.422: R207.2 109.38,40.24 108.27,39.13 T15.1
N$32  (via drill 3.2 pad 6.45)
  other vias: 109.3,105.09
N$33  (via drill 0.8 pad 1.78)
  Top 0.813: v23.73,31.43 v23.73,41.59
  Bottom 1.27: R16.2 33.56,47.13 28.02,41.59
  Bottom 1.422: v23.73,31.43 27.54,31.43 28.81,30.16 28.81,28.65 T4.3 | 28.18,41.59 28.34,41.59 | 28.34,41.59
  Bottom 1.676: 28.34,41.75 28.34,41.59 T5.3 | v23.73,41.59 28.02,41.59 28.18,41.59
N$34
  Bottom 0.813: R15.2 50.72,44.45 49.85,45.32 41.35,45.32 40.56,44.53 40.8,44.61 C12.1
N$35  (via drill 0.8 pad 1.78)
  Top 1.27: v46.91,58.1 v46.91,63.98
  Bottom 1.27: 54.85,76.99 54.85,71.83 P2.1 55.56,72.55 C13.1 61.91,72.53 T6.3 | 54.85,76.99 T8.3 | R20.2 54.77,77.07 54.85,76.99 | v46.91,63.98 47.15,63.98 47.39,63.74 50.96,63.74 51.83,64.61 51.83,64.69 51.91,64.77 D11.A | T5.2 23.1,36.59 21.03,38.66 21.03,44.05 28.73,51.75 28.73,55.17 31.67,58.1 v46.91,58.1
  Bottom 1.422: P2.1 55.48,72.31 51.91,68.74 D11.A | T5.2 30.24,36.59 34.01,40.36 | 34.01,40.36 35.56,41.91 C12.2 | D9.A 33.02,41.35 34.01,40.36 | C11.2 35.15,39.23 34.01,40.36
N$36
  Bottom 1.676: R19.1 69.53,65.96 67.63,64.06 61.83,64.06 56.91,68.98 | P2.2 56.91,68.98 | 56.91,68.98 P2.3
N$37  (via drill 0.8 pad 1.78)
  Top 1.27: v66.99,74.77 v61.99,74.77 | v80.01,63.9 80.01,58.34 v80.01,58.02
  Bottom 1.27: v61.99,74.77 61.99,82.79 T206.1 | C13.2 66.99,72.69 v66.99,74.77 T6.1 66.99,70.88 | 73.5,65.98 72.07,65.98 R219.1 | 73.5,65.98 D12.C | 66.99,70.88 | 66.99,70.88 71.83,70.88 73.26,69.45 | 73.26,69.45 | 73.26,69.45 73.42,69.29 73.42,66.6 | 73.42,66.6 73.42,66.06 73.5,65.98 | v80.01,63.9 74.61,63.9 73.5,65.01 73.5,66.52 73.42,66.6 | 107.71,45.48 111.28,45.48 112.47,44.29 | 95.01,36.51 94.69,36.51 C211.2 | 95.01,36.51 110.33,36.51 | 95.15,36.83 95.15,36.66 95.01,36.51 | 95.15,36.83 D10.C | T15.2 95.39,36.59 95.15,36.83 | 95.17,58.02
  Bottom 1.422: T206.1 61.91,87.23 62.94,88.26 77.55,88.26 78.74,87.07 T218.3 | v80.01,58.02 95.17,58.02 96.44,58.02 99.38,55.09 99.38,51.75 105.57,45.56 111.2,45.56 112.47,44.29 112.47,38.18 110.89,36.59 94.61,36.59 C211.2
N$38
  Bottom 1.27: T206.3 66.99,78.76 R19.2 R219.2 | R219.2
N$39
  Bottom 1.422: T6.2 64.45,78.58 | 64.45,78.58 64.45,82.87 T206.2 | R20.1 64.37,75.88 64.45,78.58
N$40
  Bottom 1.27: R11.2 49.53,39.05 47.54,41.04 T3.3
N$41  (1 unrouted)
  Bottom 1.27: T217.2 82.55,66.44 83.42,65.56 D3.C | D3.C
  Bottom 1.676: R223.2 85.23,73.56 T217.2
N$42
  Bottom 1.27: R21.1 49.55,70.02 51.83,72.31 51.83,76.09 D11.C
N$43
  Bottom 1.27: T7.1 47.23,73.58 YX.1 49.72,76.07 R21.2
N$44
  Bottom 1.27: R221.1 77.61,69.87 74.85,72.63 74.85,76.1 D12.A
N$45  (1 unrouted)
  Bottom 1.27: T217.1 80.01,73.46 R221.2
N$46
  Bottom 1.016: D3.A 98.27,65.56 100.96,68.26 115.25,68.26 117.24,66.36 117.24,57.39 116.76,56.91 114.05,56.91 R222.2
N$47  (1 unrouted)
  Bottom 1.016: 42.94,65.56 42.94,65.48
  Bottom 1.27: T7.2 | T7.2 42.94,65.56 | 42.07,73.64 42.96,73.64 44.69,71.91 T7.2 | 42.07,73.64 R23.1 | T7.2 | 42.07,73.64 42.12,73.6 | D5.A 42.86,65.48 T7.2
N$49
  Bottom 0.61: T1.1 47.07,36.67 47.54,36.19 50.64,36.19 51.75,35.08 51.75,31.43
  Bottom 1.27: R11.1 51.75,31.43 R10.1 | R10.1
N$50
  Bottom 1.27: R24.1 59.24,79.61 R224.2
N$51
  Bottom 0.813: R211.2 82.23,38.97 83.42,37.78 86.2,37.78 87.71,39.29 87.71,40 T203.3
N$52  (via drill 1 pad 1.78)
  other vias: 109.3,105.17
N$54  (1 unrouted)
  Bottom 0.813: 97.31,10.87 97.47,10.87 98.03,10.4 108.58,10.4 R208.1
  Bottom 1.016: 93.5,10.87 97.31,10.87 | 93.5,10.87
  Bottom 1.27: T218.2 76.28,80.96 77.07,80.01 82.23,80.01 83.03,80.8 83.03,83 | 83.03,83 83.03,86.84 84.22,88.03 90.17,88.03 | 90.17,88.03 109.77,88.03 111.68,86.12 | T219.2 90.49,87.71 90.17,88.03 | 83.03,83 C218*.2 | 120.41,83.11 120.41,80.88 C215.1 119.86,75.31 C216.C- | 120.25,67.87 120.25,65.88 C217.C- | D21.A 120.41,57.31 120.25,57.15
  Bottom 1.422: R208.1 112.95,14.68 112.95,30.4 118.47,35.92 F2.1
  Bottom 1.676: R204.1 C207.1 | C207.1
  Bottom 2.54: T220.C 109.38,79.39 109.38,83.74 111.44,86.12 111.68,86.12 117.39,86.12 120.41,83.11 120.41,48.74 118.73,47.05 F2.1 117.65,47.05 117.55,47.15 117.55,47.7 119.3,49.45 119.3,55.09 120.25,56.04 120.25,57.15 120.25,67.87 119.22,69.21 119.22,83.58 119.3,83.9
N$55
  Bottom 0.813: T201.1 87.07,36.12 84.45,33.5 83.26,33.5 81.04,35.72 77.87,35.72 77.07,34.93 77.07,31.43 77.15,31.35
  Bottom 1.27: R210.1 77.15,31.35 R211.1
N$56
  Bottom 1.016: T9.3 40.32,79.45 36.04,75.17 36.04,70.88
  Bottom 1.422: R25.2 31.67,68.1 34.29,70.88 36.04,70.88 39.89,70.88 R26.1
N$57
  Bottom 1.27: T219.3 93.03,73.9 90.01,70.88 87.76,70.88 R226.2 87.72,70.76 90.13,70.76 92.63,68.26 97.77,68.26 R225.1
N$58
  Bottom 1.27: R23.2 25.45,73.64 R34.2
  pour Bottom (isolate 1.016, no thermals): 13.18,73.5 13.33,72.63 24.92,72.63 26.19,73.9 26.19,80.01 25.16,81.04 22.38,81.04 21.51,80.17 21.51,75.88 13.18,75.88 13.18,75.33
N$59
  Bottom 1.422: R223.1 100.68,73.72 R234.1
  pour Bottom (isolate 1.016, no thermals): 99.77,75.72 99.77,73.1 100.57,72.31 114.78,72.31 116.76,74.3 116.76,80.01 115.65,81.12 113.9,81.12 112.79,80.01 112.79,75.72
N$60  (via drill 3.2 pad 6.45)
  other vias: 18.34,105.25
N$61  (1 unrouted)
  Bottom 6.452: F1.2 9.91,13.95 X1.1
N$62
  Bottom 1.93: R26.2 27.54,70.88 25.88,69.77 13.73,69.77 10.64,72.31 10.64,76.35 T10.B
N$63
  Bottom 1.422: X5.2 X5.1
  Bottom 6.452: F2.2 118.47,14.04 X5.2
N$64
  Bottom 1.676: R226.1 96.2,70.88 95.25,71.83 95.25,77.23 97.08,79.06 103.79,79.06 T220.B
N$66  (via drill 1 pad 1.78)
  other vias: 18.34,105.33
N$67
  Bottom 0.813: T202.1 84.53,30.96 89.38,35.8 90.79,35.8 92.74,33.85
  Bottom 1.27: LED2.A 92.59,31.39 93.89,32.69
  Bottom 1.422: C211.1 92.61,33.97 92.74,33.85 93.89,32.69 D10.A | C210.1 93.98,18.65 92.55,20.08 92.55,26.03 LED2.A
N$68  (via drill 3.2 pad 6.45)
  other vias: 37.78,98.03
N$71  (via drill 3.2 pad 6.45)
  other vias: 52.23,94.69
N$72  (via drill 3.2 pad 6.45)
  other vias: 64.29,94.77
N$73  (via drill 3.2 pad 6.45)
  other vias: 76.2,94.69
N$75  (via drill 1 pad 1.78)
  other vias: 52.23,94.77
N$76
  Bottom 1.016: 88.9,68.1 90.49,66.67 90.49,66.44 | 90.72,60.96 90.49,61.2 | R18.2 75.21,44.48 | 75.21,44.48 73.79,44.48 72.07,46.2 72.07,50.96 71.44,51.59 70.88,51.59 | 70.88,51.59 R36.1 | R40.2 70.88,51.59 | 70.88,51.59 | 70.88,51.59 70.88,50.32 R40.2 | 75.21,44.48 75.21,44.45 73.74,44.45 72.07,46.12 72.07,49.85 71.6,50.32 R40.2 | 69.37,50.32 R40.2 | R40.2 69.69,50.4
  Bottom 1.27: T7.3 | T7.3 R25.1 36.83,68.02 31.19,62.39 25.16,62.39 R28.1 | 87.55,68.34 88.58,68.34 90.49,66.44 90.49,61.2 | 87.55,68.34 T217.3 | R225.2 87.69,68.2 87.55,68.34
  Bottom 1.93: 72.39,53.1 72.55,52.94
  Bottom 2.54: R39.2 69.53,58.74 67.23,61.04 66.99,61.04 | 66.99,61.04 24.61,61.04 24.05,61.59 | R229.2 102.31,62.47 100.81,60.96 90.72,60.96 67.07,60.96 66.99,61.04
  pour Bottom (isolate 0.813, no thermals): 67.94,60.4 67.94,58.98 67.94,49.21 93.11,49.21 93.11,56.59 77.79,56.59 77.79,60.48
  pour Bottom (no thermals): 99.85,65.17 99.85,58.82 115.89,58.82 115.89,65.25 99.85,65.25
  pour Bottom (no thermals): 12.62,64.69 12.62,58.82 26.59,58.82 26.59,64.93 12.62,64.93
N$77  (via drill 0.8 pad 1.78)  (1 unrouted)
  Top 1.422: v104.06,41.59 104.06,31.35
  Bottom 1.27: R216.1 98.5,47.15 v104.06,41.59
  Bottom 1.422: v104.06,41.59 103.98,41.67
  Bottom 1.676: T15.3 101.36,34.05 102.39,33.02 | 102.39,33.02 104.06,31.35 | T14.3 100.25,30.88 102.39,33.02
N$78  (via drill 1 pad 1.78)
  other vias: 76.28,94.77
N$82  (via drill 3.2 pad 6.45)
  other vias: 90.49,97.87
N$83  (via drill 1 pad 1.78)
  other vias: 18.34,105.25
N$85  (via drill 1 pad 1.78)
  other vias: 37.78,98.03
N$87  (via drill 1 pad 1.78)
  other vias: 90.49,97.95
N$88  (via drill 1 pad 1.78)
  other vias: 64.06,93.34
N$89  (via drill 0.8 pad 1.93)  (1 unrouted)
  Top 1.27: v88.98,15.95 78.66,15.95 v78.73,16.04
  Bottom 1.016: v78.73,16.04 79.04,16.05
  Bottom 1.27: v78.73,16.04 79.02,16.04 79.04,16.05 | P1.1 61.91,10.79 64.13,8.1 80.33,8.1 81.83,9.92 81.83,15.32 81.2,15.95 78.9,15.95 | 49.37,11.03 C6.2 | C5.C+ 89.06,15.88 v88.98,15.95 | D1.C 49.37,10.87 R4.1
  Bottom 1.422: v88.98,15.95 88.98,15.88
  Bottom 1.676: R4.1 49.37,11.03 61.51,11.03 P1.1
  pour Bottom (no thermals): 85.72,19.13 85.72,15.4 86.04,15.08 89.85,15.08 90.41,15.64 90.41,18.81 89.77,19.45 86.04,19.45
N$90  (via drill 1 pad 1.78)
  other vias: 64.37,94.77
N$180
  Bottom 3.81: 20.71,52.55 20.71,50.56 R44.2 | 20.71,52.55 R43.2 | C20*.2 20.63,52.63 20.71,52.55
N$181  (2 unrouted)
  Bottom 1.27: C1.1 64.47,24.23
  Bottom 1.422: K1.1 63.18,21.35 64.45,22.62 C3.1
  Bottom 1.93: C1.1 60.66,24.23 C2.1
OUT
  pour Bottom (isolate 0.813, no thermals): 49.69,56.28 52.23,58.82 60.56,58.82 60.56,49.45 34.85,49.37 34.85,56.28
(copper drawn outside any net)
  shapes: Bottom area x2

### Text on the board
Bottom: MIR 50